# EAGLE design Seeeduino_V2.2 (EAGLE 5.06)
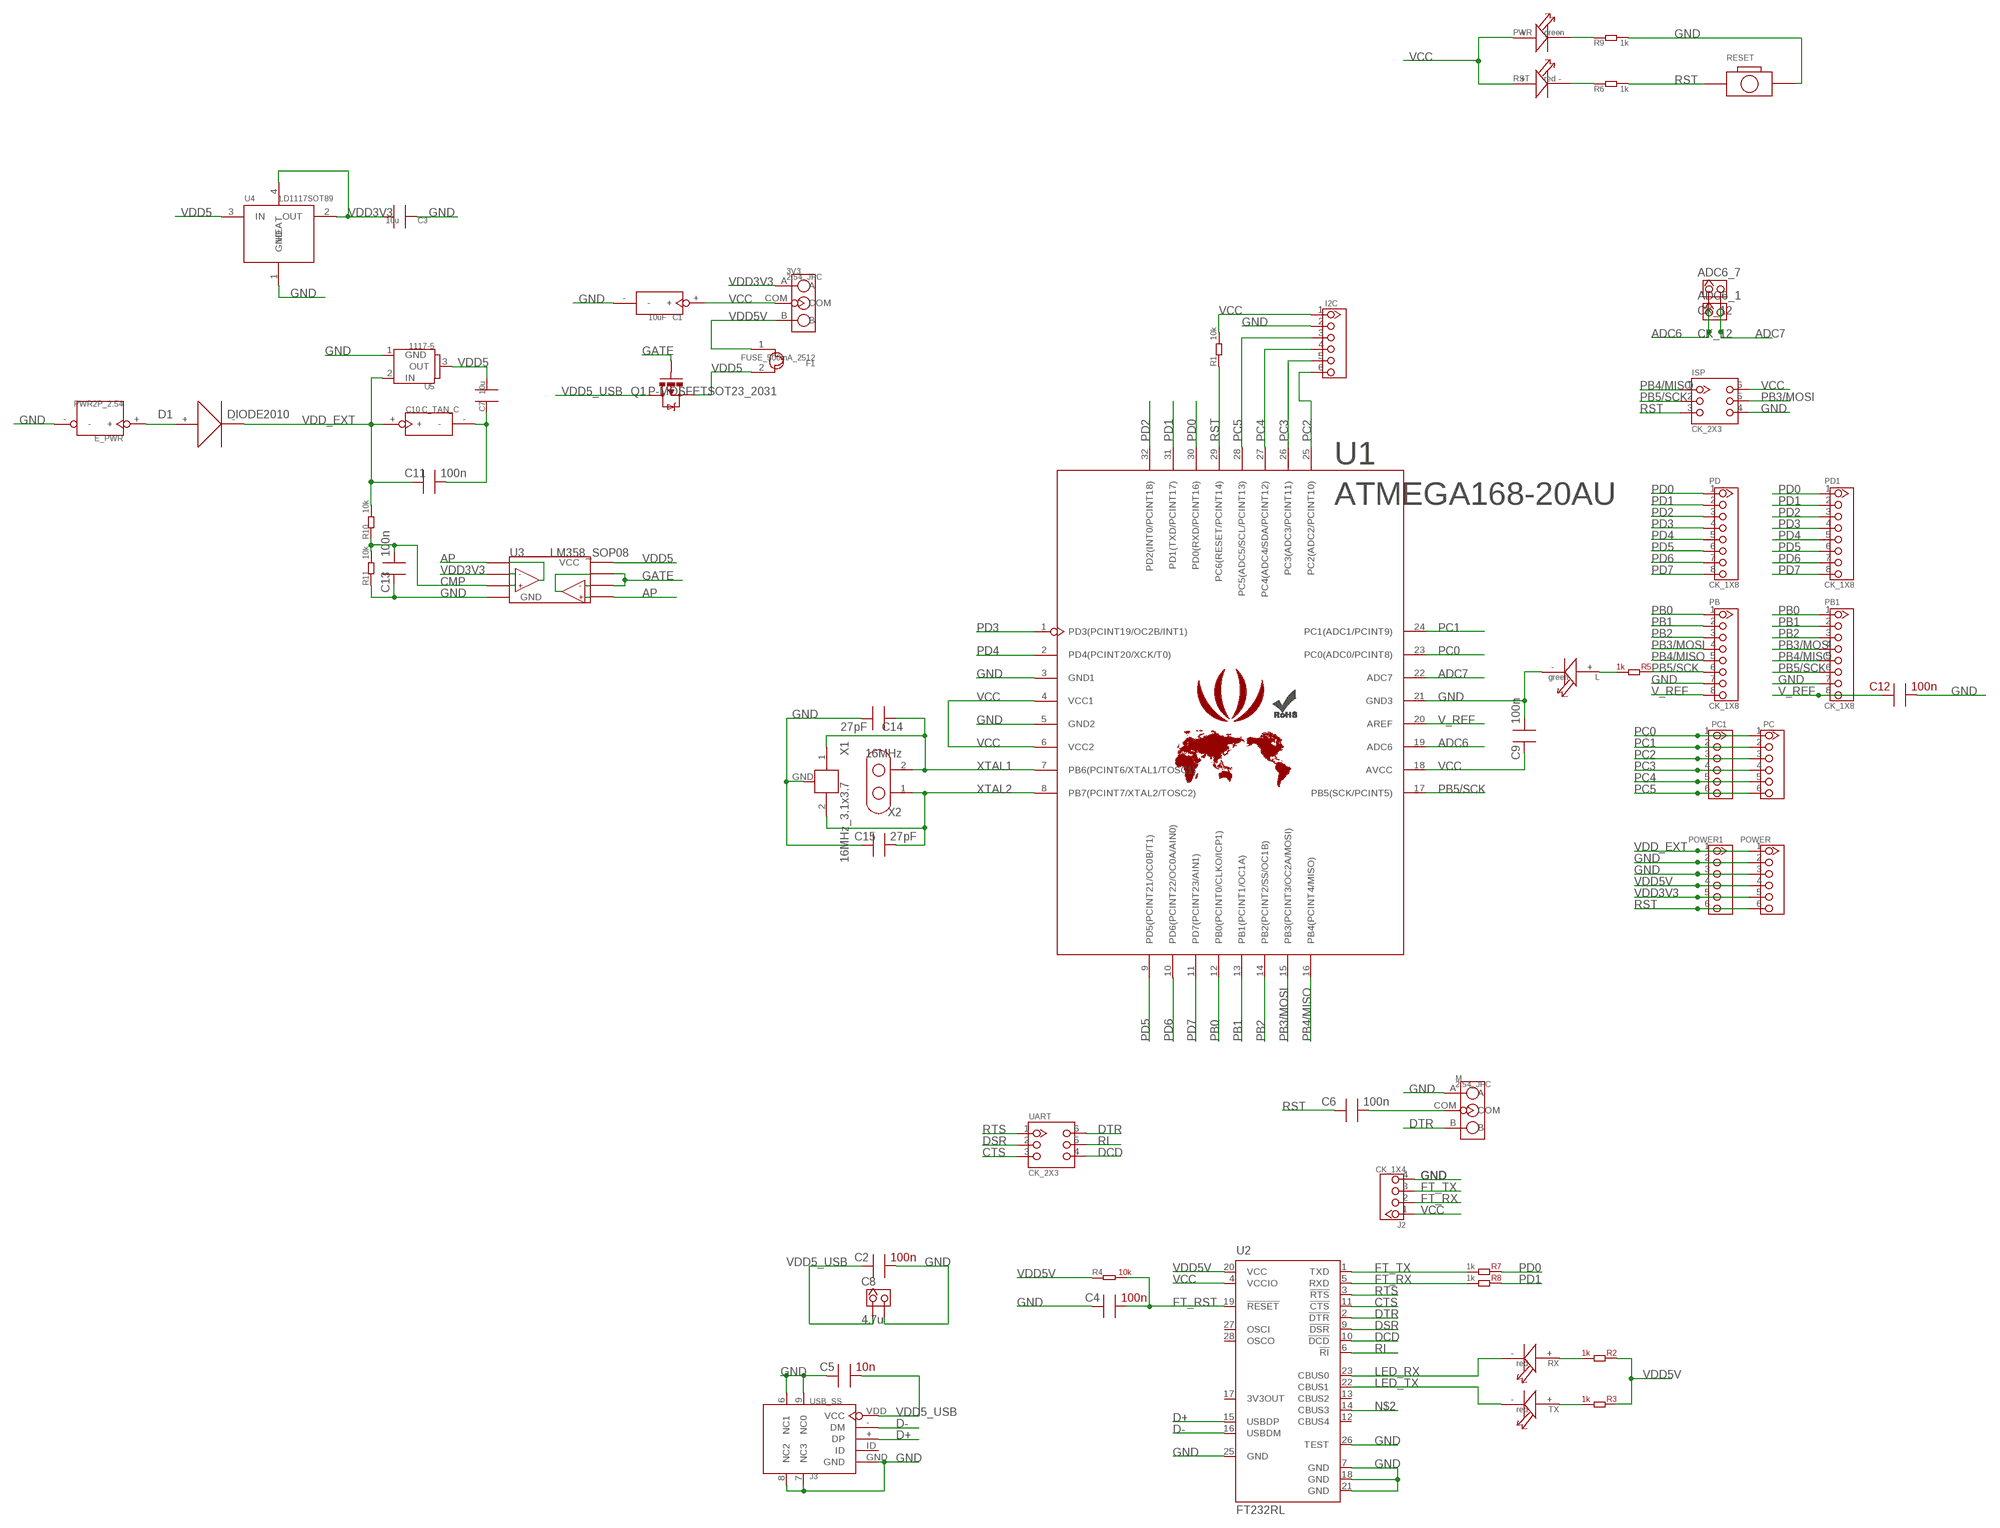
[diagram p0: schematic, sheet 1]

## Parts
3V3  2.54_JPC  [2.54_JP_C]
ADC6_1  CK_12  [CK_1*2]
ADC6_7  CK_12  [CK_1*2]
C1  10uF  C_TAN_C  [TYPE_C]
C2  100n  C0603  [0603]
C3  10u  C0805  [0805]
C4  100n  C0603  [0603]
C5  10n  C0603  [0603]
C6  100n  C0603  [0603]
C7  10u  C0805  [0805]
C8  4.7u  CK_12  [CK_1*2]
C9  100n  C0603  [0603]
C10  C_TAN_C  [TYPE_C]
C11  100n  C0603  [0603]
C12  100n  C0603  [0603]
C13  100n  C0603  [0603]
C14  27pF  C0603  [0603]
C15  27pF  C0603  [0603]
D1  DIODE2010  [DIODE_2010]
E_PWR  PWR2P_2.54  [PWR_JST]
F1  FUSE_500mA_2512  FUSE_500MA2512  [2512]
I2C  HEADER_1X6  [CK_1X6]
ISP  CK_2X3  CK_2X3_DD  [CK_2X3]
J2  CK_1X4  CK_1X4_DD  [CK_1X4]
J3  USB_SS  [USB_B_S]
L  green  LED0805  [LED0805]
LOGO1  ROHS_MASK  [ROHS_MASK]
M  2.54_JPC  [2.54_JP_C]
PB  CK_1X8  CK_1X8DD  [CK_1X8]
PB1  CK_1X8  CK_1X8DD  [CK_1X8]
PC  HEADER_1X6  [CK_1X6]
PC1  HEADER_1X6  [CK_1X6]
PD  CK_1X8  CK_1X8DD  [CK_1X8]
PD1  CK_1X8  CK_1X8DD  [CK_1X8]
POWER  HEADER_1X6  [CK_1X6]
POWER1  HEADER_1X6  [CK_1X6]
PWR  green  LED0805  [LED0805]
Q1  P-MOSFETSOT23_2031  P-MOSFET_SOT23  [SOT23]
R1  10k  R0603  [0603]
R2  1k  R0603  [0603]
R3  1k  R0603  [0603]
R4  10k  R0603  [0603]
R5  1k  R0603  [0603]
R6  1k  R0603  [0603]
R7  1k  R0603  [0603]
R8  1k  R0603  [0603]
R9  1k  R0603  [0603]
R10  10k  R0603  [0603]
R11  10k  R0603  [0603]
RESET  BOTTON_1_DP  [BTN_5.0_RST]
RST  red  LED0805  [LED0805]
RX  red  LED0805  [LED0805]
TX  red  LED0805  [LED0805]
U1  ATMEGA168-20AU  [ATMEGA168-20AU]
U2  FT232RL  [SSOP28]
U3  LM358_SOP08  [SOP08]
U4  LD1117SOT89  [SOT89]
U5  1117-5  [TO252]
U$1  SEEEDSTUDIO  [SEEED_MASK]
U$3  WORLD_MAP_IID  [WORLD_MAP_1000X500]
UART  CK_2X3  CK_2X3_DD  [CK_2X3]
X1  16MHz_3.1x3.7  XTAL_NCHOZ  [XTAL_NC]
X2  16MHz  XTL_B  [XTL_B]

## Nets
ADC6: ADC6_1.1 ADC6_7.1 U1.19(ADC6)
ADC7: ADC6_1.2 ADC6_7.2 U1.22(ADC7)
AP: U3.1 U3.5
CMP: C13.2 R10.1 R11.2 U3.3
CTS: U2.11(!CTS) UART.3
D+: J3.+(DP) U2.15(USBDP)
D-: J3.-(DM) U2.16(USBDM)
DCD: U2.10(!DCD) UART.4
DSR: U2.9(!DSR) UART.2
DTR: M.B U2.2(!DTR) UART.6
FT_RST: C4.2 R4.2 U2.19(!RESET)
FT_RX: J2.2 R8.2 U2.5(RXD)
FT_TX: J2.3 R7.2 U2.1(TXD)
GATE: Q1.1(G) U3.6 U3.7
GND: C1.- C2.2 C3.1 C4.1 C5.1 C7.1 C8.2 C9.2 C10.- C11.2 C12.2 C13.1 C14.2 C15.1 E_PWR.- I2C.2 ISP.4 J2.4 J3.6(NC1) J3.7(NC3) J3.8(NC2) J3.9(NC0) J3.GND L.- M.A PB1.7 PB.7 POWER1.2 POWER1.3 POWER.2 POWER.3 R9.2 R11.1 RESET.P$2 U1.3(GND1) U1.5(GND2) U1.21(GND3) U2.7(GND) U2.18(GND) U2.21(GND) U2.25(GND) U2.26(TEST) U3.4(GND) U4.1(GND) U5.1(GND) X1.GND
LED_RX: RX.- U2.23(CBUS0)
LED_TX: TX.- U2.22(CBUS1)
N$1: D1.+ E_PWR.+
N$2: U2.14(CBUS3)
N$3: PWR.- R9.1
N$4: L.+ R5.2
N$5: R6.1 RST.-
N$18: C6.2 M.COM
N$31: R2.2 RX.+
N$32: R3.2 TX.+
PB0: PB1.1 PB.1 U1.12(PB0(PCINT0/CLKO/ICP1))
PB1: PB1.2 PB.2 U1.13(PB1(PCINT1/OC1A))
PB2: PB1.3 PB.3 U1.14(PB2(PCINT2/SS/OC1B))
PB3/MOSI: ISP.5 PB1.4 PB.4 U1.15(PB3(PCINT3/OC2A/MOSI))
PB4/MISO: ISP.1 PB1.5 PB.5 U1.16(PB4(PCINT4/MISO))
PB5/SCK: ISP.2 PB1.6 PB.6 R5.1 U1.17(PB5(SCK/PCINT5))
PC0: PC1.1 PC.1 U1.23(PC0(ADC0/PCINT8))
PC1: PC1.2 PC.2 U1.24(PC1(ADC1/PCINT9))
PC2: I2C.6 PC1.3 PC.3 U1.25(PC2(ADC2/PCINT10))
PC3: I2C.5 PC1.4 PC.4 U1.26(PC3(ADC3/PCINT11))
PC4: I2C.4 PC1.5 PC.5 U1.27(PC4(ADC4/SDA/PCINT12))
PC5: I2C.3 PC1.6 PC.6 U1.28(PC5(ADC5/SCL/PCINT13))
PD0: PD1.1 PD.1 R7.1 U1.30(PD0(RXD/PCINT16))
PD1: PD1.2 PD.2 R8.1 U1.31(PD1(TXD/PCINT17))
PD2: PD1.3 PD.3 U1.32(PD2(INT0/PCINT18))
PD3: PD1.4 PD.4 U1.1(PD3(PCINT19/OC2B/INT1))
PD4: PD1.5 PD.5 U1.2(PD4(PCINT20/XCK/T0))
PD5: PD1.6 PD.6 U1.9(PD5(PCINT21/OC0B/T1))
PD6: PD1.7 PD.7 U1.10(PD6(PCINT22/OC0A/AIN0))
PD7: PD1.8 PD.8 U1.11(PD7(PCINT23/AIN1))
RI: U2.6(!RI) UART.5
RST: C6.1 ISP.3 POWER1.6 POWER.6 R1.1 R6.2 RESET.P$1 U1.29(PC6(RESET/PCINT14))
RTS: U2.3(!RTS) UART.1
V_REF: C12.1 PB1.8 PB.8 U1.20(AREF)
VCC: 3V3.COM C1.+ C9.1 I2C.1 ISP.6 J2.1 PWR.+ R1.2 RST.+ U1.4(VCC1) U1.6(VCC2) U1.18(AVCC) U2.4(VCCIO)
VDD3V3: 3V3.A C3.2 POWER1.5 POWER.5 U3.2 U4.2(OUT) U4.4(HEAT)
VDD5 [usbvcc]: C7.2 F1.2 Q1.2(S) U3.8(VCC) U4.3(IN) U5.3(OUT)
VDD5_USB: C2.1 C5.2 C8.1 J3.VDD(VCC) Q1.3(D)
VDD5V [usbvcc]: 3V3.B F1.1 POWER1.4 POWER.4 R2.1 R3.1 R4.1 U2.20(VCC)
VDD_EXT: C10.+ C11.1 D1.- POWER1.1 POWER.1 R10.2 U5.2(IN)
XTAL1: C14.1 U1.7(PB6(PCINT6/XTAL1/TOSC1)) X1.1 X2.2
XTAL2: C15.2 U1.8(PB7(PCINT7/XTAL2/TOSC2)) X1.2 X2.1
Unconnected: J3.ID U2.12(CBUS4) U2.13(CBUS2) U2.17(3V3OUT) U2.27(OSCI) U2.28(OSCO)

## Library data of the parts
3V3 M = CPT_CJ:2.54_JP
ADC6_1 ADC6_7 C8 = CONNECTER:CK_1*2
C1 C10 = CPT_SMD:C_TAN
C2 C4-C6 C9 C11-C15 = CPT_SMD:C0603; C0603: 100N
C3 C7 = CPT_SMD:C0805
D1 = CPT_SMD:DIODE
E_PWR = CONNECTER:PWR2P_2.54
F1 = CPT_SMD:FUSE_500MA
I2C PC PC1 POWER POWER1 = CONNECTER:HEADER_1X6
ISP UART = CONNECTER:CK_2X3
J2 = CONNECTER:CK_1X4
J3 = CONNECTER:USB
L PWR RST RX TX = CPT_SMD:LED0805
LOGO1 = logo:ROHS
PB PB1 PD PD1 = CONNECTER:CK_1X8
Q1 = CPT_SMD:P-MOSFET
R1-R11 = CPT_SMD:R0603
RESET = CPT_SMD:BOTTON_1
U1 = IC_SMD:ATMEGA168-20AU
U2 = IC_SMD:FT232R: Source: http://www.ftdichip.com/Documents/DataSheets/DS_FT232R_v104.pdf
U3 = ICs_v54:LM358
U4 = ICs:LD1117
U5 = ICs:1117-5
U$1 = logo:SEEEDSTUDIO
U$3 = logo:WORLD_MAP
X1 = CPT_SMD:XTAL_NC
X2 = CPT_CJ:XTL_B

## Net classes
0 default: width 0.203 mm, drill 0.305 mm, clearance 0.203 mm
1 power: width 0.203 mm, drill 0.305 mm, clearance 0.203 mm
2 gnd: width 0.203 mm, drill 0.305 mm, clearance 0.203 mm
3 usbvcc: width 0.203 mm, drill 0.305 mm, clearance 0.203 mm

## Board
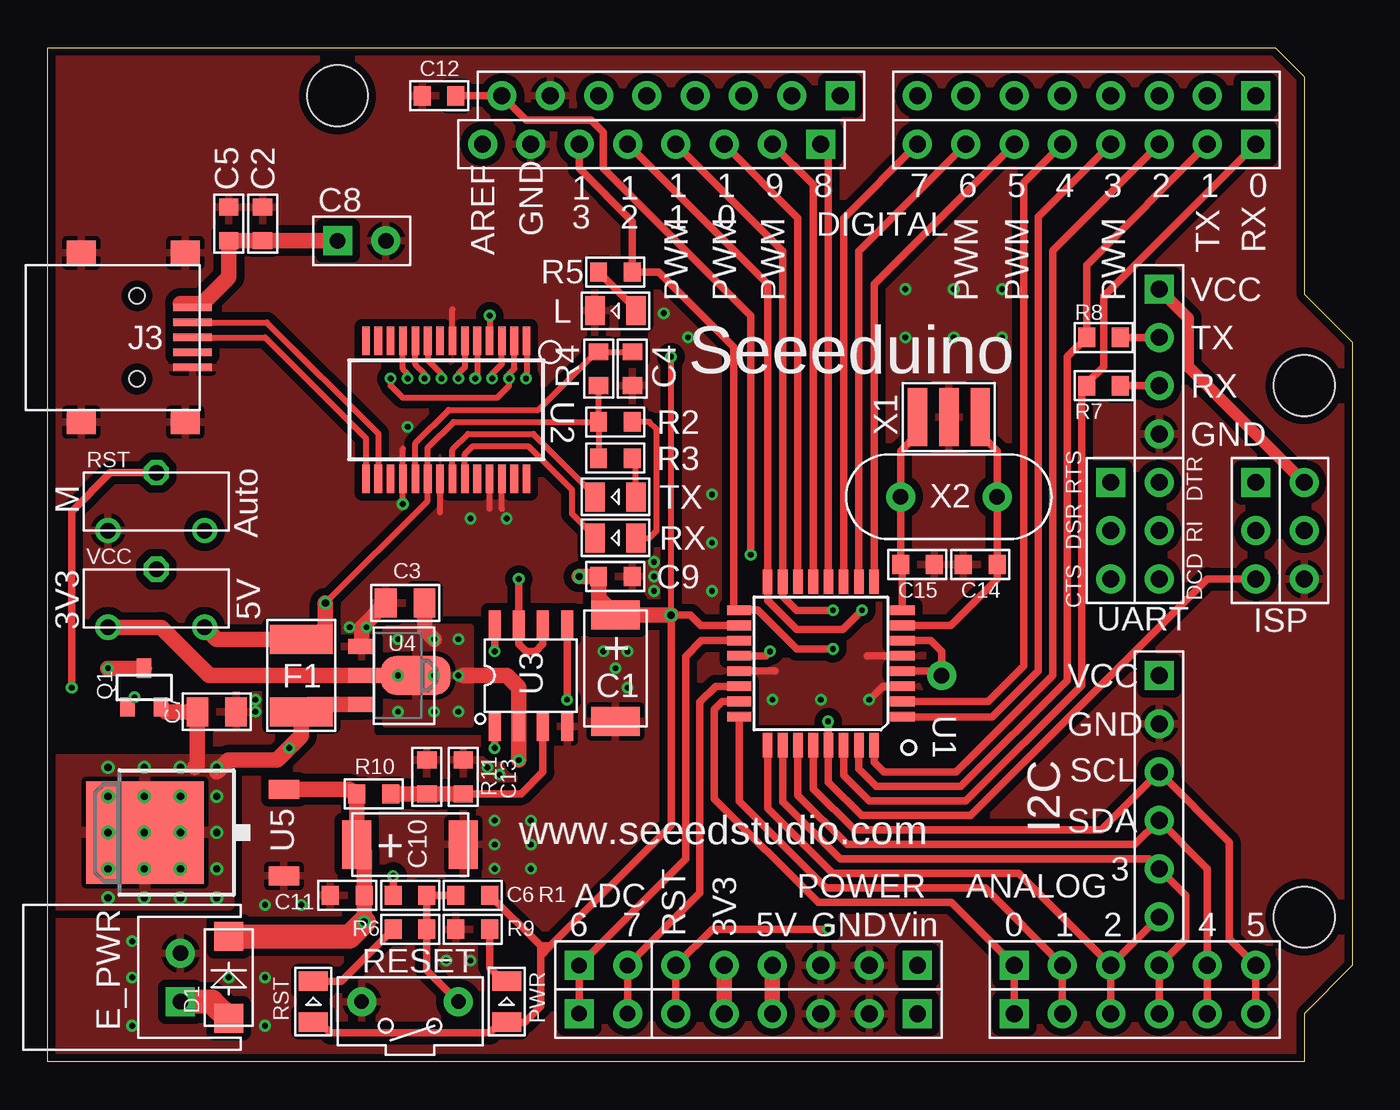
[diagram p1: board, top side]
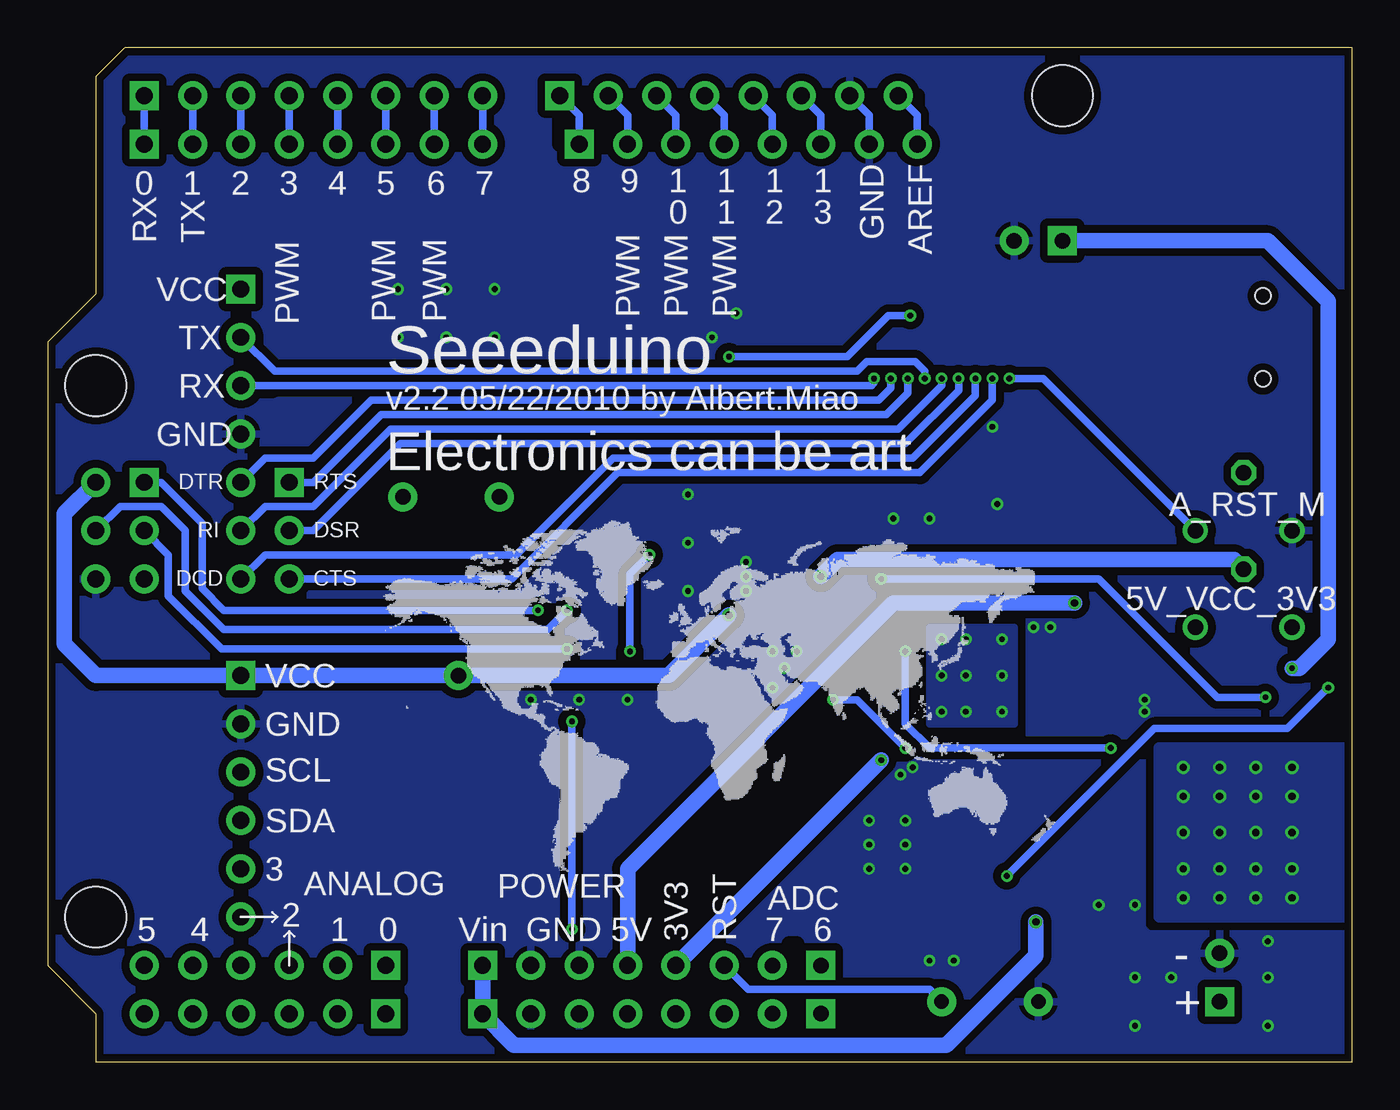
[diagram p2: board, bottom side, seen from below]

Size 68.58 x 53.34 mm. Coordinates in mm from the lower left corner, seen from the top.
Outline: 0,0 0,53.34 64.52,53.34 66.04,51.82 66.04,40.39 68.58,37.85 68.58,5.08 66.04,2.54 66.04,0 0,0
Copper layers (1*16): Top 0.035mm / dielectric 1.5mm / Bottom 0.035mm
Design rules "rule_manufacture_limit": minimum track width 8mil, minimum drill 12mil, track to track 6mil, track to pad 6mil, pad to pad 6mil, via to via 10mil, smd to smd 0mil, copper to edge 10mil, drill to drill 10mil, minimum pad ring 10mil, minimum via ring 6mil, stop-mask expansion 2mil, vias tented up to drill 25mil, thermal gap 10mil
Holes 3.2 mm at 15.24,50.8 66.04,7.62 66.04,35.56
tRestrict: area 23.1,30 to 24,31.4
bRestrict: area 45.7,48.3 to 63.5,50.8; area 22.9,48.3 to 41.7,50.8; area 63.5,25.4 to 66,30.5; area 27.9,2.5 to 45.7,5.1; area 50.8,2.5 to 63.5,5.1; area 56.8,35.3 to 57,35.7; area 29.2,6 to 29.6,6.2; area 57,24.5 to 57.3,24.8

### Footprints (pad centres in the part's own frame; a part is rotated, then mirrored left to right if it is on the bottom)
2.54_JP_C = drill 0.813 round: A -1.27,2.54; B -1.27,-2.54 | drill 0.813 octagon: COM 1.778,0
CK_1*2@1 = drill 0.813 pad 1.524 square: 1 0,1.27 | drill 0.813 pad 1.524 round: 2 0,-1.27
TYPE_C = smd 1.524 x 2.54: + -2.794,0; - 2.794,0
0603 = smd 0.889 x 1.016: 1 -0.889,0; 2 0.889,0
0805 = smd 1.143 x 1.524: 1 -1.016,0; 2 1.016,0
DIODE_2010 = smd 1.524 x 1.524: + 0,-2.159; - 0,2.159
PWR_JST = drill 0.813 pad 1.524 square: + 0,-1.27 | drill 0.813 pad 1.524 round: - 0,1.27
2512 = smd 1.524 x 3.302: 1 -1.905,0; 2 1.905,0
CK_1X6 = drill 0.889 pad 1.524 square: 1 0,6.35 | drill 0.889 pad 1.524 round: 2 0,3.81; 3 0,1.27; 4 0,-1.27; 5 0,-3.81; 6 0,-6.35
CK_2X3 = drill 0.889 pad 1.524 square: 1 -1.27,2.54 | drill 0.889 pad 1.524 round: 2 -1.27,0; 3 -1.27,-2.54; 4 1.27,-2.54; 5 1.27,0; 6 1.27,2.54
CK_1X4 = drill 0.889 pad 1.524 square: 1 0,3.81 | drill 0.889 pad 1.524 round: 2 0,1.27; 3 0,-1.27; 4 0,-3.81
USB_B_S = smd 1.524 x 1.27: 6 0.762,-4.445; 7 6.223,-4.445; 8 6.223,4.445; 9 0.762,4.445 | smd 2.032 x 0.406: + 0.381,0; - 0.381,-0.787; GND 0.381,1.575; ID 0.381,0.787; VDD 0.381,-1.575 | hole 0.813: 3.302,2.184; 3.302,-2.184
LED0805 = smd 1.016 x 1.524: + -1.077,0; - 1.077,0
CK_1X8 = drill 0.889 pad 1.524 square: 1 0,8.89 | drill 0.889 pad 1.524 round: 2 0,6.35; 3 0,3.81; 4 0,1.27; 5 0,-1.27; 6 0,-3.81; 7 0,-6.35; 8 0,-8.89
SOT23 = smd 0.762 x 1.016: 1 -0.889,-1.016; 2 0.889,-1.016; 3 0,1.016
BTN_5.0_RST = drill 0.762 pad 1.524 round: P$1 0,2.54; P$2 0,-2.54
ATMEGA168-20AU = smd 1.27 x 0.508: 1 -4.293,2.8; 2 -4.293,2; 3 -4.293,1.2; 4 -4.293,0.4; 5 -4.293,-0.4; 6 -4.293,-1.2; 7 -4.293,-2; 8 -4.293,-2.8; 17 4.293,-2.8; 18 4.293,-2; 19 4.293,-1.2; 20 4.293,-0.4; 21 4.293,0.4; 22 4.293,1.2; 23 4.293,2; 24 4.293,2.8 | smd 0.508 x 1.27: 9 -2.8,-4.293; 10 -2,-4.293; 11 -1.2,-4.293; 12 -0.4,-4.293; 13 0.4,-4.293; 14 1.2,-4.293; 15 2,-4.293; 16 2.8,-4.293; 25 2.8,4.293; 26 2,4.293; 27 1.2,4.293; 28 0.4,4.293; 29 -0.4,4.293; 30 -1.2,4.293; 31 -2,4.293; 32 -2.8,4.293
SSOP28 = smd 0.4 x 1.5: 1 -4.225,-3.625; 2 -3.575,-3.625; 3 -2.925,-3.625; 4 -2.275,-3.625; 5 -1.625,-3.625; 6 -0.975,-3.625; 7 -0.325,-3.625; 8 0.325,-3.625; 9 0.975,-3.625; 10 1.625,-3.625; 11 2.275,-3.625; 12 2.925,-3.625; 13 3.575,-3.625; 14 4.225,-3.625; 15 4.225,3.625; 16 3.575,3.625; 17 2.925,3.625; 18 2.275,3.625; 19 1.625,3.625; 20 0.975,3.625; 21 0.325,3.625; 22 -0.325,3.625; 23 -0.975,3.625; 24 -1.625,3.625; 25 -2.275,3.625; 26 -2.925,3.625; 27 -3.575,3.625; 28 -4.225,3.625
SOP08 = smd 0.635 x 1.524: 1 -1.905,-2.667; 2 -0.635,-2.667; 3 0.635,-2.667; 4 1.905,-2.667; 5 1.905,2.667; 6 0.635,2.667; 7 -0.635,2.667; 8 -1.905,2.667
SOT89 = smd 0.8 x 1.4: 1 -1.524,-1.905; 3 1.524,-1.905 | smd 0.8 x 1.9: 2 0,-1.651 | smd 2.032 x 3.65: 4 0,0.94
TO252 = smd 1 x 1.6: 1 -2.28,-4.8; 2 2.28,-4.8 | smd 5.4 x 6.2: 3 0,2.5
XTAL_NC = smd 1.016 x 3.048: 1 -1.651,0; 2 1.651,0; GND 0,0
XTL_B = drill 0.813 pad 1.524 round: 1 0,2.54; 2 0,-2.54

### Placement (x,y rotation side)
3V3  5.71,24.13 90 top
ADC6_1  CK_12  [CK_1*2@1]  29.21,5.08 90 top
ADC6_7  CK_12  [CK_1*2@1]  29.21,2.54 90 top
C1  29.84,20.7 270 top
C2  11.3,44.07 90 top
C3  18.8,24.13 0 top
C4  30.73,36.45 90 top
C5  9.53,44.07 270 top
C6  19.05,8.76 180 top
C7  8.89,18.41 180 top
C8  4.7u  [CK_1*2@1]  16.51,43.18 90 top
C9  29.84,25.53 0 top
C10  19.05,11.43 0 top
C11  15.75,8.76 180 top
C12  20.57,50.8 180 top
C13  21.84,14.99 270 top
C14  49.02,26.16 180 top
C15  45.72,26.16 180 top
D1  9.53,4.45 0 top
E_PWR  6.99,4.45 0 top
F1  13.34,20.32 270 top
I2C  58.42,13.97 0 top
ISP  64.77,27.94 0 top
J2  58.42,36.83 0 top
J3  8,38.1 180 top
L  29.84,39.5 180 top
LOGO1  64.01,16.89 0 top
M  5.71,29.21 90 top
PB  32.77,50.8 270 top
PB1  31.75,48.26 270 top
PC  57.15,2.54 90 top
PC1  57.15,5.08 90 top
PD  54.61,50.8 270 top
PD1  54.61,48.26 270 top
POWER  39.37,2.54 270 top
POWER1  39.37,5.08 270 top
PWR  24.13,3.17 90 top
Q1  5.08,19.68 0 top
R1  22.35,8.76 0 top
R2  29.84,33.66 0 top
R3  29.84,31.75 0 top
R4  28.96,36.45 90 top
R5  29.84,41.53 180 top
R6  19.05,6.99 0 top
R7  55.5,35.56 0 top
R8  55.5,38.1 0 top
R9  22.35,6.99 180 top
R10  17.14,14.1 180 top
R11  19.94,14.99 270 top
RESET  19.05,3.17 270 top
RST  13.97,3.17 90 top
RX  29.84,27.56 180 top
TX  29.84,29.72 180 top
U1  40.64,20.95 180 top
U2  20.95,34.29 180 top
U3  25.4,20.32 0 top
U4  18.41,20.32 270 top
U5  7.62,12.06 90 top
U$1  4.45,48.9 0 top
U$3  23.5,19.68 0 bottom
UART  57.15,27.94 0 top
X1  47.37,33.91 180 top
X2  47.37,29.72 90 top

### Tracks (layer width: path | path; a pad name or v marks a point on that pad's centre or on a via)
ADC6
  Top 0.406: U1.19 34.35,22.16 33.53,21.34 33.53,10.67 ADC6_1.1 ADC6_7.1
ADC7
  Top 0.406: U1.22 35.12,19.75 34.29,18.92 34.29,8.89 ADC6_1.2 ADC6_7.2
AP  (via drill 0.3)
  Top 0.406: v27.3,19.05 U3.5 | U3.1 v23.5,16.51
  Bottom 0.406: v23.5,16.51 26.04,19.05 v27.3,19.05
CMP
  Top 0.406: C13.2 24.89,14.1 26.04,15.24 U3.3
  Top 0.813: R10.1 R11.2 C13.2
CTS  (via drill 0.3)
  Top 0.305: U2.11 18.68,36.44 18.92,36.2 v18.92,35.94
  Bottom 0.406: UART.3 44.2,25.4 38.61,30.99 22.73,30.99 18.92,34.8 v18.92,35.94
D+
  Top 0.305: U2.15 16.73,32.8 11.43,38.1 J3.+
D-
  Top 0.305: U2.16 17.38,33.04 11.53,38.89 J3.-
DCD  (via drill 0.3)
  Top 0.305: U2.10 19.33,36.68 19.81,36.2 v19.81,35.94
  Bottom 0.406: UART.4 57.15,26.67 43.94,26.67 38.86,31.75 23.11,31.75 19.81,35.05 v19.81,35.94
DSR  (via drill 0.3)
  Top 0.305: U2.9 19.98,36.92 20.7,36.2 v20.7,35.94
  Bottom 0.406: v20.7,35.94 20.7,35.31 23.5,32.51 50.04,32.51 54.61,27.94 UART.2
DTR  (via drill 0.3)
  Top 0.305: U2.2 24.53,36.47 24.26,36.2 v24.26,35.94 24.26,35.56 23.62,34.92 18.67,34.92 18.03,35.56 v18.03,35.94
  Bottom 0.406: v24.26,35.94 24.26,35.43 24.89,34.8 51.56,34.8 54.61,31.75 57.15,31.75 UART.6 | M.B 16.26,35.94 v18.03,35.94
FT_RST
  Top 0.305: C4.2 R4.2 28.83,37.34 25.78,34.29 21.08,34.29 19.33,32.54 U2.19
FT_RX  (via drill 0.3)
  Top 0.305: U2.5 22.58,36.04 v22.48,35.94
  Top 0.406: J2.2 R8.2
  Bottom 0.406: J2.2 56.64,36.32 26.04,36.32 25.53,36.83 22.99,36.83 22.48,36.32 v22.48,35.94
FT_TX  (via drill 0.3)
  Top 0.305: U2.1 25.18,36.23 25.15,36.2 v25.15,35.94
  Top 0.406: J2.3 R7.2
  Bottom 0.406: J2.3 25.27,35.56 25.15,35.69 v25.15,35.94
GATE  (via drill 0.3)
  Top 0.305: Q1.1 4.19,18.8 v4.57,19.18
  Top 0.406: U3.6 26.04,21.97 25.65,21.59 25.15,21.59 24.77,21.97 U3.7 v24.77,25.4
  Bottom 0.406: v24.77,25.4 13.34,25.4 7.11,19.18 v4.57,19.18
GND  (via drill 0.3)
  Top 0.305: U2.7 21.28,39.57 | 18.68,32.25 U2.18 v18.68,29.35 | 23.88,29.09 U2.26 | 23.23,29.09 U2.25 | 20.63,28.9 U2.21
  Top 0.406: U1.21 38.25,20.55 | 43.07,21.36 U1.5 | U1.3 43.88,19.75 v43.18,19.05
  Top 0.813: U4.1 16.51,22.86 C3.1
  Bottom 0.406: PB.7 25.4,49.78 PB1.7
  other vias: 24.13,28.57 22.23,28.57 31.88,25.53 31.88,26.29 31.88,24.77 40.64,19.05 38.1,19.05 50.16,38.1 47.62,38.1 45.09,38.1 45.09,40.64 47.62,40.64 50.16,40.64 34.92,24.77 34.92,27.3 34.92,29.84 33.66,38.1 32.38,39.37 4.45,6.35 4.45,4.45 4.45,1.91 9.53,4.45 11.43,4.45 11.43,1.91 13.34,8.26 11.43,8.26 22.23,5.33 20.95,5.33 18.92,33.4 16.76,22.86 10.92,18.41 23.11,15.49 23.75,15.11 10.92,19.05 15.88,22.86 23.5,12.7 23.5,11.43 23.5,10.16 25.4,10.16 25.4,12.7 25.4,11.43 29.84,20.7 29.21,21.59 30.48,21.59 30.48,19.68
  pour Top: -6.35,52.7 -5.08,52.7 -5.08,51.44 -6.35,51.44
  pour Top (isolate 0.406, rank 6): 0,53.34 64.52,53.34 66.04,51.82 66.04,40.39 68.58,37.85 68.58,5.08 66.04,2.54 66.04,0 0,0
  pour Bottom (isolate 0.406, rank 6): 0,53.34 64.52,53.34 66.04,51.82 66.04,40.39 68.58,37.85 68.58,5.08 66.04,2.54 66.04,0 0,0
LED_RX
  Top 0.305: 28.96,27.56 RX.- 28.77,27.62 27.56,28.83 27.56,30.1 25.27,32.38 22.35,32.38 21.93,31.96 U2.23
LED_TX
  Top 0.305: 28.83,29.72 28.96,29.72 | 28.83,29.72 TX.- | 28.83,29.72 25.53,33.02 22.1,33.02 21.28,32.2 U2.22
N$1
  Top 1.27: E_PWR.+ 8.64,3.17 D1.+
N$3
  Top 0.406: R9.1 23.24,4.95 23.88,4.32 24.06,4.32 PWR.-
N$4
  Top 0.406: L.+ 30.99,39.5 R5.2
N$5
  Top 0.406: RST.- 15.43,4.25 R6.1
N$18  (via drill 0.3)
  Top 0.406: v18.16,9.78 C6.2 | M.COM 3.3,30.99 1.27,28.96 v1.27,19.68
  Bottom 0.406: v18.16,9.78 10.41,17.53 3.43,17.53 v1.27,19.68
N$31
  Top 0.305: RX.+ 31.62,27.56 32,27.94 32,33.27 31.62,33.66 R2.2
N$32
  Top 0.305: TX.+ 30.92,31.56 R3.2
  Top 0.406: TX.+ 30.73,29.72
PB0
  Top 0.406: U1.12 41.04,47.86 PB1.1
  Bottom 0.406: PB1.1 40.64,49.78 PB.1
PB1
  Top 0.406: U1.13 40.24,46.12 PB1.2
  Bottom 0.406: PB1.2 38.1,49.78 PB.2
PB2
  Top 0.406: U1.14 39.44,44.38 PB1.3
  Bottom 0.406: PB1.3 35.56,49.78 PB.3
PB3/MOSI  (via drill 0.3)
  Top 0.406: v41.27,23.75 39.37,23.75 38.64,24.48 U1.15 38.64,42.64 PB1.4
  Bottom 0.406: ISP.5 64.77,29.21 62.61,29.21 61.34,27.94 61.34,24.77 59.31,22.73 42.29,22.73 v41.27,23.75 | PB1.4 33.02,49.78 PB.4
PB4/MISO  (via drill 0.3)
  Top 0.406: PB1.5 37.84,40.9 U1.16 37.84,24.26 39.37,22.73 41.78,22.73 v42.8,23.75
  Bottom 0.406: ISP.1 62.62,30.48 60.45,28.32 60.45,24.89 59.31,23.75 v42.8,23.75 | PB1.5 30.48,49.78 PB.5
PB5/SCK  (via drill 0.3)
  Top 0.406: v41.27,21.72 39.37,21.72 37.33,23.75 U1.17 36.07,23.75 36.07,37.59 32.13,41.53 R5.1 30.73,44.2 27.94,46.99 PB1.6
  Bottom 0.406: ISP.2 62.23,26.67 62.23,24.51 59.44,21.72 v41.27,21.72 | PB1.6 27.94,49.78 PB.6
PC0
  Top 0.406: U1.23 35.47,18.95 35.05,18.54 35.05,13.84 40.51,8.38 47.5,8.38 PC1.1 PC.1
PC1
  Top 0.406: U1.24 36.35,13.69 40.89,9.14 49.28,9.14 PC1.2 PC.2
PC2
  Top 0.406: U1.25 37.84,13.34 41.27,9.91 51.05,9.91 PC1.3 | PC1.3 PC.3 | PC1.3 I2C.6
PC3
  Top 0.406: U1.26 38.64,13.68 41.66,10.67 57.91,10.67 I2C.5 59.82,8.76 59.82,6.48 PC1.4 PC.4
PC4
  Top 0.406: U1.27 39.44,14.03 42.04,11.43 57.15,11.43 I2C.4 60.96,10.16 PC1.5 PC.5
PC5
  Top 0.406: U1.28 40.24,14.37 42.42,12.19 55.37,12.19 I2C.3 62.1,11.56 62.1,6.48 PC1.6 PC.6
PD0
  Top 0.406: U1.30 41.84,15.06 43.18,13.72 48.26,13.72 54.36,19.81 54.36,35.31 R7.1 54.61,35.69 55.5,36.58 55.5,40.26 PD1.1
  Bottom 0.406: PD1.1 PD.1
PD1
  Top 0.406: U1.31 42.64,15.4 43.56,14.48 48.01,14.48 53.59,20.07 53.59,37.08 R8.1 54.61,41.91 PD1.2
  Bottom 0.406: PD1.2 PD.2
PD2
  Top 0.406: U1.32 43.44,15.74 43.94,15.24 47.75,15.24 52.83,20.32 52.83,42.67 PD1.3
  Bottom 0.406: PD1.3 PD.3
PD3
  Top 0.406: U1.1 49.65,18.16 52.07,20.57 52.07,44.45 PD1.4
  Bottom 0.406: PD1.4 PD.4
PD4
  Top 0.406: U1.2 49.44,18.95 51.31,20.83 51.31,46.23 PD1.5
  Bottom 0.406: PD1.5 PD.5
PD5
  Top 0.406: U1.9 43.44,40.9 PD1.6
  Bottom 0.406: PD1.6 PD.6
PD6
  Top 0.406: U1.10 42.64,42.64 PD1.7
  Bottom 0.406: PD1.7 PD.7
PD7
  Top 0.406: U1.11 41.84,44.38 PD1.8
  Bottom 0.406: PD1.8 PD.8
RI  (via drill 0.3)
  Top 0.305: U2.6 21.93,36.53 21.59,36.2 v21.59,35.94
  Bottom 0.406: v21.59,35.94 21.59,35.56 23.88,33.27 50.55,33.27 54.61,29.21 57.15,29.21 UART.5
RST  (via drill 0.3)
  Top 0.406: POWER.6 POWER1.6 34.92,6.99 v41.02,6.99 | ISP.3 60.96,25.4 48.51,12.95 42.8,12.95 41.04,14.71 U1.29 41.04,17.89 v41.02,17.91 | RESET.P$1 19.94,4.83 R6.2 C6.1 R1.1
  Bottom 0.406: RESET.P$1 22.23,3.81 31.75,3.81 POWER1.6 | v41.02,6.99 v41.02,17.91
RTS  (via drill 0.3)
  Top 0.305: U2.3 23.88,36.71 23.37,36.2 v23.37,35.94
  Bottom 0.406: v23.37,35.94 23.37,35.18 24.51,34.04 51.05,34.04 54.61,30.48 UART.1
V_REF  (via drill 0.3)
  Top 0.406: C12.1 PB.8 25.15,49.53 28.57,49.53 29.21,48.9 29.21,46.99 36.96,39.24 v36.96,26.67 | U1.20 37.74,21.36 v37.97,21.59
  Bottom 0.406: PB1.8 22.86,49.78 PB.8 | v37.97,21.59 37.97,25.65 v36.96,26.67
VCC  (via drill 0.3, 0.38, 0.81 pad 1.52)
  Top 0.305: v32.77,23.5 v32.77,37.08 | U2.4 v23.23,39.23 v23.24,39.24
  Top 0.406: U1.4 46.76,20.55 v46.99,20.32 46.99,21.59 46.42,22.16 U1.6 | RST.+ 14.29,2.1 14.86,1.52 23.24,1.52 23.82,2.1 PWR.+ 25.09,2.1 25.91,2.92 25.91,5.59 | 25.91,5.59 26.16,5.84 25.91,6.1 | 26.42,6.1 25.91,6.1 | 25.91,5.59 26.42,6.1 | 26.42,6.1 32.77,12.45 v32.77,23.5 33.78,23.5 34.32,22.95 U1.18 | 25.91,5.59 25.91,6.1 | 25.91,6.1 R1.2
  Top 0.61: ISP.6 59.94,36.58 59.94,39.12 J2.1
  Top 0.813: v32.77,23.5 C1.+ 28.96,24.38 C9.1 v27.94,25.53
  Bottom 0.406: v32.77,37.08 26.54,37.08 24.38,39.24 v23.24,39.24
  Bottom 0.813: ISP.6 67.69,28.83 67.69,21.97 66.04,20.32 I2C.1 v46.99,20.32 35.94,20.32 v32.77,23.5 | 3V3.COM 6.22,26.42 27.05,26.42 v27.94,25.53
VDD3V3  (via drill 0.3)
  Top 0.406: U4.2 v18.41,20.32 U4.4
  Top 0.813: POWER1.5 POWER.5 | U4.2 8.51,20.32 5.97,22.86 3V3.A | v24.77,15.88 U3.2 24.77,19.68 24.13,20.32 21.84,20.32 | C3.2 19.81,22.73 v20.32,22.23
  Bottom 0.813: v24.77,15.88 POWER1.5
  other vias: 20.32,20.32 18.41,22.23 18.41,18.41 20.32,18.41 21.59,22.23 21.59,20.32 21.59,18.41
  pour Top (isolate 0.406): 17.78,22.86 22.23,22.86 22.23,17.78 17.78,17.78
  pour Bottom (isolate 0.406): 17.78,22.86 22.23,22.86 22.23,17.78 17.78,17.78
VDD5  (via drill 0.3, 0.38)
  Top 0.406: v23.5,21.59 U3.8
  Top 0.813: 7.75,15.49 7.87,15.62 C7.2 6.22,18.41 Q1.2 | U4.3 13.72,18.8 F1.2 13.34,17.14 v12.7,16.51 12.06,15.88 9.53,15.88 8.89,15.24
  Bottom 0.406: v23.5,21.59 23.5,17.78 22.23,16.51 v12.7,16.51
  other vias: 5.08,12.06 5.08,13.97 5.08,10.16 6.99,10.16 6.99,12.06 6.99,13.97 3.17,13.97 3.17,12.06 3.17,10.16 3.17,15.49 5.08,15.49 6.99,15.49 8.89,12.06 8.89,10.16 8.89,13.97 8.89,15.49 3.17,8.64 5.08,8.64 6.99,8.64 8.89,8.64
  pour Top (isolate 0.406): 0,15.88 9.53,15.88 9.53,8.26 0,8.26
  pour Bottom (isolate 0.406): 10.16,7.62 10.16,16.51 0,16.51 0,7.62
VDD5_USB  (via drill 0.3)
  Top 0.305: 7.62,39.88 J3.VDD
  Top 0.813: C8.1 C2.1 C5.2 9.53,41.27 8.13,39.88 7.62,39.88 6.99,39.88 | v3.17,20.7 Q1.3
  Bottom 0.813: v3.17,20.7 2.79,20.7 1.27,22.23 1.27,40.01 4.45,43.18 C8.1
VDD5V  (via drill 0.38)
  Top 0.305: R2.1 R4.1 | R2.1 R3.1 | R2.1 21.34,33.66 19.98,32.3 U2.20 19.98,29.5 v14.61,24.13
  Top 0.813: POWER1.4 POWER.4 | 3V3.B 8.89,22.23 F1.1 13.97,22.23 14.61,22.86 v14.61,24.13
  Bottom 0.813: POWER1.4 38.1,10.16 24.13,24.13 v14.61,24.13
VDD_EXT  (via drill 0.38)
  Top 0.813: v16.64,7.37 C11.1 16.64,11.05 C10.+ 16.26,13.97 | 16.26,13.97 R10.2 | U5.2 15.88,14.35 16.26,13.97
  Top 1.27: D1.- 15.88,6.6 v16.64,7.37
  Bottom 0.813: POWER1.1 POWER.1 44.07,0.89 21.34,0.89 16.64,5.59 v16.64,7.37
XTAL1
  Top 0.406: U1.7 47.47,22.95 49.91,25.4 C14.1 X2.2 49.91,32.13 49.02,33.02 X1.1
XTAL2
  Top 0.406: U1.8 44.93,26.06 C15.2 X2.1 44.83,32.13 45.72,33.02 X1.2

### Text on the board
tPlace: 1 | 1 | 1 | 1 | 9 | 8 | 7 | 6 | 5 | 4 | 3 | 2 | 1 | 0 | 3 | 2 | 1 | 0 | GND | DIGITAL | TX | RX | AREF | PWM | PWM | PWM | PWM | PWM | PWM | VCC | TX | Seeeduino | RX | GND | RST | RTS | DTR | Auto | DSR | RI | VCC | CTS | DCD | 5V | VCC | GND | SCL | SDA | www.seeedstudio.com | 3 | POWER | ANALOG | ADC | 6 | 7 | RST | 3V3 | 5V | GND | Vin | 0 | 1 | 2 | 4 | 5
bPlace: AREF | GND | 1 | 1 | 1 | 1 | 9 | 8 | 7 | 6 | 5 | 4 | 3 | 2 | 1 | 0 | 3 | 2 | 1 | PWM | 0 | PWM | PWM | PWM | PWM | PWM | TX | RX | VCC | TX | Seeeduino | RX | v2.2 05/22/2010 by Albert.Miao | GND | Electronics can be art | RTS | DTR | A_RST_M | DSR | RI | CTS | DCD | 5V_VCC_3V3 | VCC | GND | SCL | SDA | 3 | POWER | ANALOG | ADC | 2 | 6 | 7 | RST | 3V3 | 5V | GND | Vin | 0 | 1 | 4 | 5 | - | +